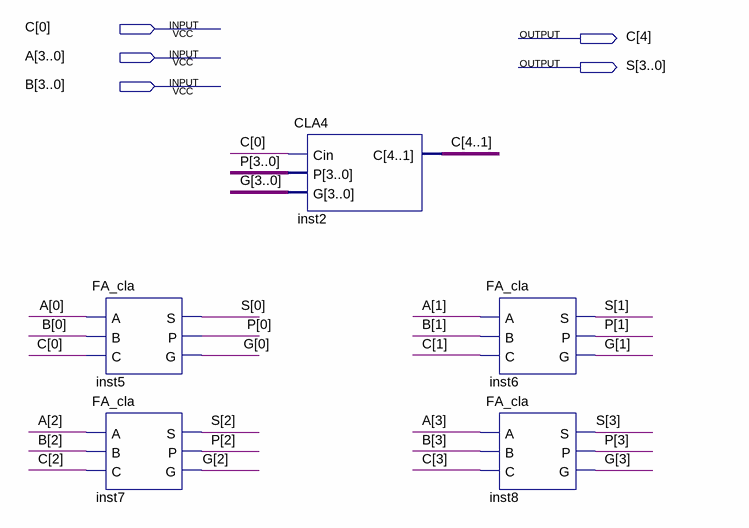
[diagram p0: schematic sheet]
// Quartus schematic CLA.bdf as structural Verilog: 5 symbols, 5 pins
module CLA (
  inout  [4:0] C,
  input  [3:0] A,
  input  [3:0] B,
  output [3:0] S
);

  wire [3:0] G, P;

  FA_cla inst5 (.A(A[0]), .B(B[0]), .C(C[0]), .S(S[0]), .P(P[0]), .G(G[0]));
  FA_cla inst7 (.A(A[2]), .B(B[2]), .C(C[2]), .S(S[2]), .P(P[2]), .G(G[2]));
  CLA4 inst2 (.Cin(C[0]), .P(P), .G(G), .C(C[4:1]));
  FA_cla inst6 (.A(A[1]), .B(B[1]), .C(C[1]), .S(S[1]), .P(P[1]), .G(G[1]));
  FA_cla inst8 (.A(A[3]), .B(B[3]), .C(C[3]), .S(S[3]), .P(P[3]), .G(G[3]));
endmodule
